# Altium schematic sheet UARTSTM.SchDoc
size 199 x 250 mm; SheetNumber: 10; SheetTotal: 13
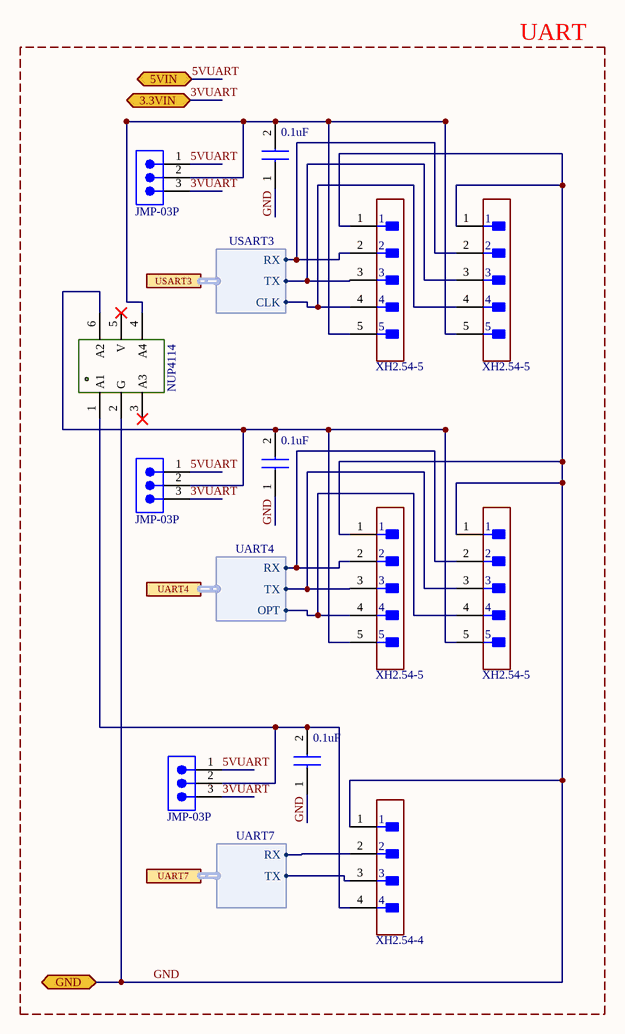
[diagram p0: UARTSTM.SchDoc]

## Parts
CAPUART3  0.1uF  [CAP0805]
CAPUART4  0.1uF  [CAP0805]
CAPUART7  0.1uF  [CAP0805]
JMPUART3  JMP-03P  [JMP-03P]
JMPUART4  JMP-03P  [JMP-03P]
JMPUART7  JMP-03P  [JMP-03P]
NUPUART  NUP4114  [NUP4114]
UART3-1  XH2.54-5  [XH2.54-5]
UART3-2  XH2.54-5  [XH2.54-5]
UART4-1  XH2.54-5  [XH2.54-5]
UART4-2  XH2.54-5  [XH2.54-5]
UART7-1  XH2.54-4  [XH2.54-4]

## Blocks framed on the sheet
UART: CAPUART3 CAPUART4 CAPUART7 JMPUART3 JMPUART4 JMPUART7 NUPUART UART3-1 UART3-2 UART4-1 UART4-2 UART7-1

## Ports
3.3VIN (bidir, see CONTROL_PCB_MAIN[5C], ADC1[2B], I2C[2A], I_O[1A], MOTORS[2B], RELAY_5V_3.3V_LEVEL[3B], SPI[1A]), 5VIN (bidir, see CONTROL_PCB_MAIN[5C], ADC1[2B], I2C[2A], I_O[1A], LEDS[1A], MOTORS[2B], RELAY_5V_3.3V_LEVEL[3B], SPI[1A]), GND (bidir, see CONTROL_PCB_MAIN[5C], ADC1[2D], CAN[2C], I2C[2D], I_O[1C], LEDS[1D], MOTORS[2D], RELAY_5V_3.3V_LEVEL[5C], RELAY_12VV_VDD_LEVEL[5B], SPI[1D], STM32[1D]), UART4 (harness UART4, see CONTROL_PCB_MAIN[5C], STM32[3D]), UART7 (harness UART7, see CONTROL_PCB_MAIN[5C], STM32[3D]), USART3 (harness USART3, see CONTROL_PCB_MAIN[5C], STM32[4D])

## Harnesses
UART7: RX, TX
USART3: RX, TX, CLK
UART4: RX, TX, OPT

## Nets
3VUART: JMPUART3.3 JMPUART4.3 JMPUART7.3 ; port 3.3VIN
5VUART: JMPUART3.1 JMPUART4.1 JMPUART7.1 ; port 5VIN
GND: CAPUART3.1 CAPUART4.1 CAPUART7.1 NUPUART.2(G) UART3-1.1 UART3-2.1 UART4-1.1 UART4-2.1 UART7-1.1 ; port GND
NetCAPUART3_2: CAPUART3.2 JMPUART3.2 NUPUART.4(A4) UART3-1.5 UART3-2.5
NetCAPUART4_2: CAPUART4.2 JMPUART4.2 NUPUART.6(A2) UART4-1.5 UART4-2.5
NetCAPUART7_2: CAPUART7.2 JMPUART7.2 NUPUART.1(A1) UART7-1.4
NetUART3-1_2: UART3-1.2 UART3-2.2 ; port USART3.RX
NetUART3-1_3: UART3-1.3 UART3-2.3 ; port USART3.TX
NetUART3-1_4: UART3-1.4 UART3-2.4 ; port USART3.CLK
NetUART4-1_2: UART4-1.2 UART4-2.2 ; port UART4.RX
NetUART4-1_3: UART4-1.3 UART4-2.3 ; port UART4.TX
NetUART4-1_4: UART4-1.4 UART4-2.4 ; port UART4.OPT
NetUART7-1_2: UART7-1.2 ; port UART7.RX
NetUART7-1_3: UART7-1.3 ; port UART7.TX

Not connected (* = marked no-connect by the designer): NUPUART 3(A3)* 5(V)*

## Library data of the parts
CAPUART3 CAPUART4 CAPUART7 = CAP0805: CAP-SMD0805
JMPUART3 JMPUART4 JMPUART7 = JMP-03P: PLS-1x3
NUPUART = NUP4114: NUP4114HMR6T1G
UART3-1 UART3-2 UART4-1 UART4-2 = XH2.54-5: JST XH2.54-5pin
UART7-1 = XH2.54-4: JST XH2.54-4pin